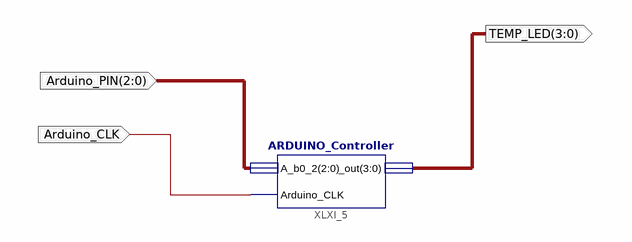
[diagram p0: schematic sheet 1]
// Xilinx ISE schematic testPin.sch (spartan6) as structural Verilog: 1 symbols, 3 ports
module testPin (
  input  [2:0] Arduino_PIN,
  input  Arduino_CLK,
  output [3:0] TEMP_LED
);

  ARDUINO_Controller XLXI_5 (.A_b0_2(Arduino_PIN), .Arduino_CLK(Arduino_CLK), ._out(TEMP_LED));
endmodule
